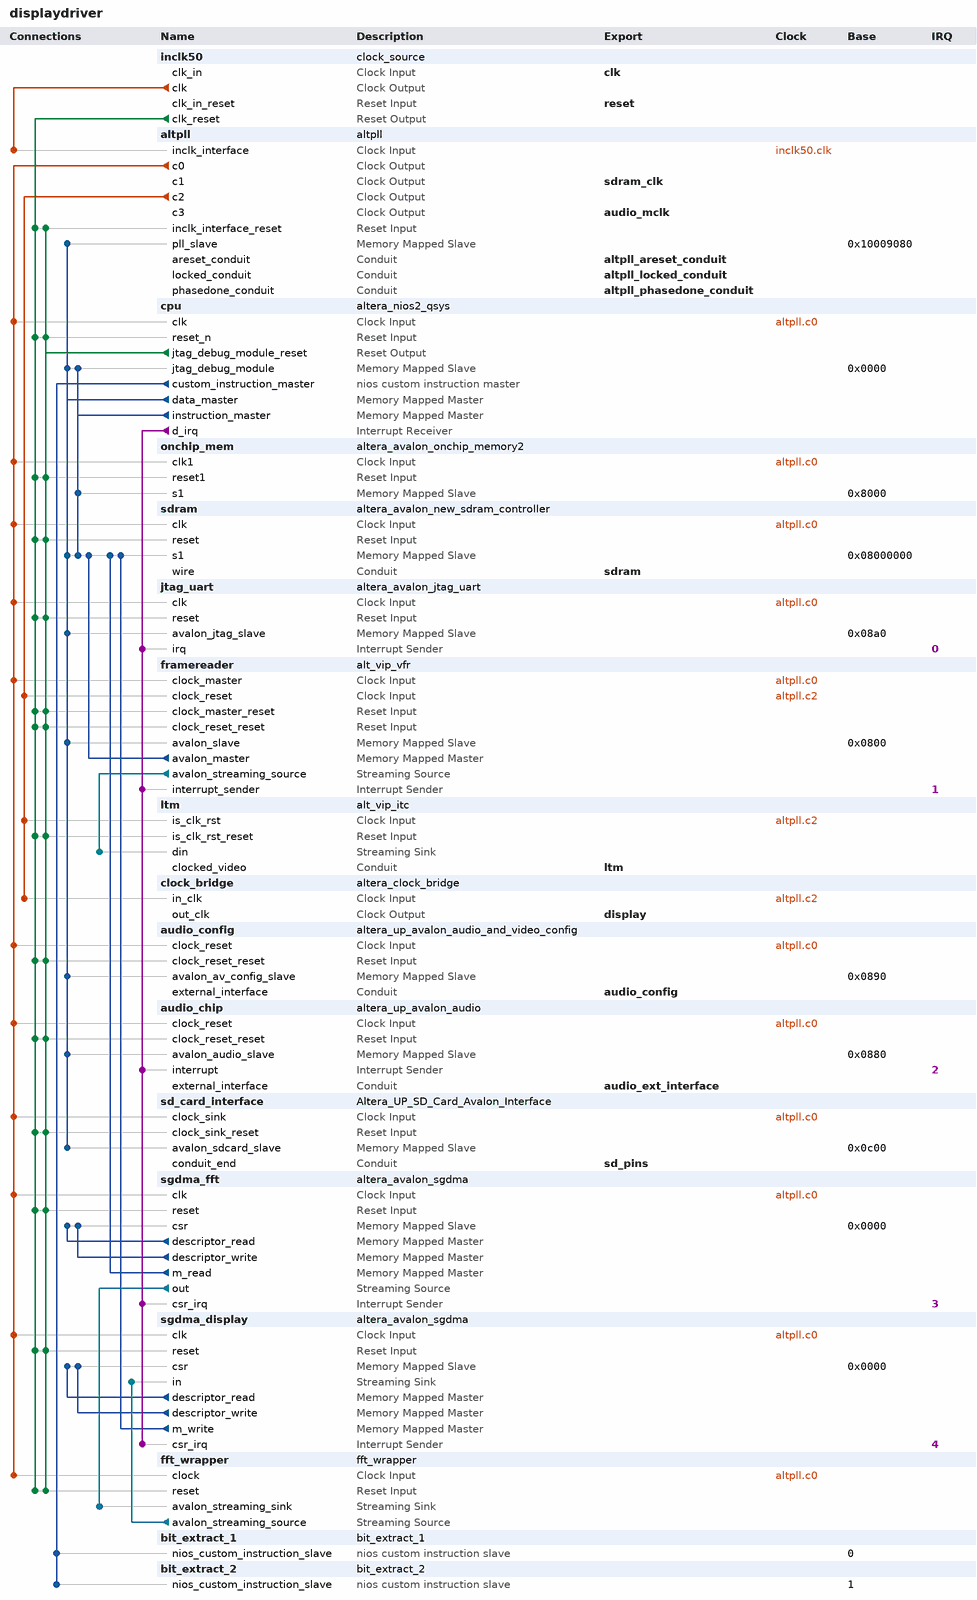
[diagram p0: system contents]
# Platform Designer (Qsys) system displaydriver, Cyclone IV E EP4CE115F29C7
# Parameters at their usual value, and those the tool derives, are not listed.
package require -exact qsys 13.1
create_system displaydriver
set_project_property DEVICE_FAMILY {Cyclone IV E}
set_project_property DEVICE EP4CE115F29C7

add_instance inclk50 clock_source 13.1
set_instance_parameter_value inclk50 clockFrequency 50000000

add_instance altpll altpll 13.1
set_instance_parameter_value altpll INCLK0_INPUT_FREQUENCY 20000
set_instance_parameter_value altpll CLK0_MULTIPLY_BY 2
set_instance_parameter_value altpll CLK1_MULTIPLY_BY 2
set_instance_parameter_value altpll CLK2_MULTIPLY_BY 1
set_instance_parameter_value altpll CLK3_MULTIPLY_BY 3528
set_instance_parameter_value altpll CLK0_DIVIDE_BY 1
set_instance_parameter_value altpll CLK1_DIVIDE_BY 1
set_instance_parameter_value altpll CLK2_DIVIDE_BY 2
set_instance_parameter_value altpll CLK3_DIVIDE_BY 15625
set_instance_parameter_value altpll CLK1_PHASE_SHIFT -1833
set_instance_parameter_value altpll CLK2_PHASE_SHIFT 0
set_instance_parameter_value altpll CLK3_PHASE_SHIFT 0
set_instance_parameter_value altpll CLK1_DUTY_CYCLE 50
set_instance_parameter_value altpll CLK2_DUTY_CYCLE 50
set_instance_parameter_value altpll CLK3_DUTY_CYCLE 50
set_instance_parameter_value altpll PORT_clk1 PORT_USED
set_instance_parameter_value altpll PORT_clk2 PORT_USED
set_instance_parameter_value altpll PORT_clk3 PORT_USED
set_instance_parameter_value altpll PORT_ARESET PORT_USED
set_instance_parameter_value altpll PORT_LOCKED PORT_USED

add_instance cpu altera_nios2_qsys 13.1
set_instance_parameter_value cpu resetSlave onchip_mem.s1
set_instance_parameter_value cpu exceptionSlave onchip_mem.s1
set_instance_parameter_value cpu breakSlave cpu.jtag_debug_module
set_instance_parameter_value cpu muldiv_multiplierType LogicElementsFast
set_instance_parameter_value cpu impl Small
set_instance_parameter_value cpu icache_size 4096

add_instance onchip_mem altera_avalon_onchip_memory2 13.1
set_instance_parameter_value onchip_mem dataWidth 32
set_instance_parameter_value onchip_mem dualPort false
set_instance_parameter_value onchip_mem initMemContent true
set_instance_parameter_value onchip_mem initializationFileName onchip_mem
set_instance_parameter_value onchip_mem memorySize 20480

add_instance sdram altera_avalon_new_sdram_controller 13.1
set_instance_parameter_value sdram TAC 5.5
set_instance_parameter_value sdram TRCD 20.0
set_instance_parameter_value sdram TRP 20.0
set_instance_parameter_value sdram casLatency 3
set_instance_parameter_value sdram columnWidth 10
set_instance_parameter_value sdram dataWidth 32
set_instance_parameter_value sdram generateSimulationModel true
set_instance_parameter_value sdram model custom
set_instance_parameter_value sdram numberOfBanks 4
set_instance_parameter_value sdram numberOfChipSelects 1
set_instance_parameter_value sdram powerUpDelay 100.0
set_instance_parameter_value sdram refreshPeriod 15.625
set_instance_parameter_value sdram rowWidth 13

add_instance jtag_uart altera_avalon_jtag_uart 13.1
set_instance_parameter_value jtag_uart simInteractiveOptions INTERACTIVE_ASCII_OUTPUT

add_instance framereader alt_vip_vfr 13.1
set_instance_parameter_value framereader NUMBER_OF_CHANNELS_IN_PARALLEL 3
set_instance_parameter_value framereader MAX_IMAGE_WIDTH 800
set_instance_parameter_value framereader MAX_IMAGE_HEIGHT 480
set_instance_parameter_value framereader MEM_PORT_WIDTH 32

add_instance ltm alt_vip_itc 13.1
set_instance_parameter_value ltm NUMBER_OF_COLOUR_PLANES 3
set_instance_parameter_value ltm H_ACTIVE_PIXELS 800
set_instance_parameter_value ltm V_ACTIVE_LINES 480
set_instance_parameter_value ltm FIFO_DEPTH 1024
set_instance_parameter_value ltm CLOCKS_ARE_SAME 1
set_instance_parameter_value ltm THRESHOLD 1023
set_instance_parameter_value ltm H_SYNC_LENGTH 1
set_instance_parameter_value ltm H_FRONT_PORCH 40
set_instance_parameter_value ltm H_BACK_PORCH 216
set_instance_parameter_value ltm V_SYNC_LENGTH 1
set_instance_parameter_value ltm V_FRONT_PORCH 10
set_instance_parameter_value ltm V_BACK_PORCH 35

add_instance clock_bridge altera_clock_bridge 13.1
set_instance_parameter_value clock_bridge DERIVED_CLOCK_RATE 25000000
set_instance_parameter_value clock_bridge EXPLICIT_CLOCK_RATE 0

add_instance audio_config altera_up_avalon_audio_and_video_config 13.1
set_instance_parameter_value audio_config board DE2-115
set_instance_parameter_value audio_config audio_in {Microphone to ADC}
set_instance_parameter_value audio_config line_in_bypass false
set_instance_parameter_value audio_config bit_length 16
set_instance_parameter_value audio_config sampling_rate {48 kHz}

add_instance audio_chip altera_up_avalon_audio 13.1
set_instance_parameter_value audio_chip avalon_bus_type {Memory Mapped}
set_instance_parameter_value audio_chip audio_in true
set_instance_parameter_value audio_chip dw 16

add_instance sd_card_interface Altera_UP_SD_Card_Avalon_Interface 13.1

add_instance sgdma_fft altera_avalon_sgdma 13.1
set_instance_parameter_value sgdma_fft enableBurstTransfers false
set_instance_parameter_value sgdma_fft enableUnalignedTransfers false
set_instance_parameter_value sgdma_fft readBlockDataWidth 16
set_instance_parameter_value sgdma_fft readBurstcountWidth 16
set_instance_parameter_value sgdma_fft sinkErrorWidth 0
set_instance_parameter_value sgdma_fft sourceErrorWidth 0
set_instance_parameter_value sgdma_fft transferMode MEMORY_TO_STREAM
set_instance_parameter_value sgdma_fft writeBurstcountWidth 4

add_instance sgdma_display altera_avalon_sgdma 13.1
set_instance_parameter_value sgdma_display enableBurstTransfers false
set_instance_parameter_value sgdma_display enableUnalignedTransfers false
set_instance_parameter_value sgdma_display readBlockDataWidth 16
set_instance_parameter_value sgdma_display sinkErrorWidth 2
set_instance_parameter_value sgdma_display sourceErrorWidth 0
set_instance_parameter_value sgdma_display transferMode STREAM_TO_MEMORY
set_instance_parameter_value sgdma_display writeBurstcountWidth 4

add_instance fft_wrapper fft_wrapper 1.0

add_instance bit_extract_1 bit_extract_1 1.0

add_instance bit_extract_2 bit_extract_2 1.0

# connections
add_connection altpll.c0 audio_chip.clock_reset clock
add_connection altpll.c0 audio_config.clock_reset clock
add_connection altpll.c0 cpu.clk clock
add_connection altpll.c0 fft_wrapper.clock clock
add_connection altpll.c0 framereader.clock_master clock
add_connection altpll.c0 jtag_uart.clk clock
add_connection altpll.c0 onchip_mem.clk1 clock
add_connection altpll.c0 sd_card_interface.clock_sink clock
add_connection altpll.c0 sdram.clk clock
add_connection altpll.c0 sgdma_display.clk clock
add_connection altpll.c0 sgdma_fft.clk clock
add_connection altpll.c2 clock_bridge.in_clk clock
add_connection altpll.c2 framereader.clock_reset clock
add_connection altpll.c2 ltm.is_clk_rst clock
add_connection inclk50.clk altpll.inclk_interface clock
add_connection cpu.jtag_debug_module_reset altpll.inclk_interface_reset reset
add_connection cpu.jtag_debug_module_reset audio_chip.clock_reset_reset reset
add_connection cpu.jtag_debug_module_reset audio_config.clock_reset_reset reset
add_connection cpu.jtag_debug_module_reset cpu.reset_n reset
add_connection cpu.jtag_debug_module_reset fft_wrapper.reset reset
add_connection cpu.jtag_debug_module_reset framereader.clock_master_reset reset
add_connection cpu.jtag_debug_module_reset framereader.clock_reset_reset reset
add_connection cpu.jtag_debug_module_reset jtag_uart.reset reset
add_connection cpu.jtag_debug_module_reset ltm.is_clk_rst_reset reset
add_connection cpu.jtag_debug_module_reset onchip_mem.reset1 reset
add_connection cpu.jtag_debug_module_reset sd_card_interface.clock_sink_reset reset
add_connection cpu.jtag_debug_module_reset sdram.reset reset
add_connection cpu.jtag_debug_module_reset sgdma_display.reset reset
add_connection cpu.jtag_debug_module_reset sgdma_fft.reset reset
add_connection inclk50.clk_reset altpll.inclk_interface_reset reset
add_connection inclk50.clk_reset audio_chip.clock_reset_reset reset
add_connection inclk50.clk_reset audio_config.clock_reset_reset reset
add_connection inclk50.clk_reset cpu.reset_n reset
add_connection inclk50.clk_reset fft_wrapper.reset reset
add_connection inclk50.clk_reset framereader.clock_master_reset reset
add_connection inclk50.clk_reset framereader.clock_reset_reset reset
add_connection inclk50.clk_reset jtag_uart.reset reset
add_connection inclk50.clk_reset ltm.is_clk_rst_reset reset
add_connection inclk50.clk_reset onchip_mem.reset1 reset
add_connection inclk50.clk_reset sd_card_interface.clock_sink_reset reset
add_connection inclk50.clk_reset sdram.reset reset
add_connection inclk50.clk_reset sgdma_display.reset reset
add_connection inclk50.clk_reset sgdma_fft.reset reset
add_connection cpu.data_master altpll.pll_slave avalon
set_connection_parameter_value cpu.data_master/altpll.pll_slave baseAddress 0x10009080
add_connection cpu.data_master audio_chip.avalon_audio_slave avalon
set_connection_parameter_value cpu.data_master/audio_chip.avalon_audio_slave baseAddress 0x0880
add_connection cpu.data_master audio_config.avalon_av_config_slave avalon
set_connection_parameter_value cpu.data_master/audio_config.avalon_av_config_slave baseAddress 0x0890
add_connection cpu.data_master cpu.jtag_debug_module avalon
set_connection_parameter_value cpu.data_master/cpu.jtag_debug_module baseAddress 0x0000
add_connection cpu.data_master framereader.avalon_slave avalon
set_connection_parameter_value cpu.data_master/framereader.avalon_slave baseAddress 0x0800
add_connection cpu.data_master jtag_uart.avalon_jtag_slave avalon
set_connection_parameter_value cpu.data_master/jtag_uart.avalon_jtag_slave baseAddress 0x08a0
add_connection cpu.data_master sd_card_interface.avalon_sdcard_slave avalon
set_connection_parameter_value cpu.data_master/sd_card_interface.avalon_sdcard_slave baseAddress 0x0c00
add_connection cpu.data_master sdram.s1 avalon
set_connection_parameter_value cpu.data_master/sdram.s1 baseAddress 0x08000000
add_connection cpu.instruction_master cpu.jtag_debug_module avalon
set_connection_parameter_value cpu.instruction_master/cpu.jtag_debug_module baseAddress 0x0000
add_connection cpu.instruction_master onchip_mem.s1 avalon
set_connection_parameter_value cpu.instruction_master/onchip_mem.s1 baseAddress 0x8000
add_connection cpu.instruction_master sdram.s1 avalon
set_connection_parameter_value cpu.instruction_master/sdram.s1 baseAddress 0x08000000
add_connection framereader.avalon_master sdram.s1 avalon
set_connection_parameter_value framereader.avalon_master/sdram.s1 baseAddress 0x08000000
add_connection sgdma_display.descriptor_read sgdma_display.csr avalon
set_connection_parameter_value sgdma_display.descriptor_read/sgdma_display.csr baseAddress 0x0000
add_connection sgdma_display.descriptor_write sgdma_display.csr avalon
set_connection_parameter_value sgdma_display.descriptor_write/sgdma_display.csr baseAddress 0x0000
add_connection sgdma_display.m_write sdram.s1 avalon
set_connection_parameter_value sgdma_display.m_write/sdram.s1 baseAddress 0x08000000
add_connection sgdma_fft.descriptor_read sgdma_fft.csr avalon
set_connection_parameter_value sgdma_fft.descriptor_read/sgdma_fft.csr baseAddress 0x0000
add_connection sgdma_fft.descriptor_write sgdma_fft.csr avalon
set_connection_parameter_value sgdma_fft.descriptor_write/sgdma_fft.csr baseAddress 0x0000
add_connection sgdma_fft.m_read sdram.s1 avalon
set_connection_parameter_value sgdma_fft.m_read/sdram.s1 baseAddress 0x08000000
add_connection fft_wrapper.avalon_streaming_source sgdma_display.in avalon_streaming
add_connection framereader.avalon_streaming_source ltm.din avalon_streaming
add_connection sgdma_fft.out fft_wrapper.avalon_streaming_sink avalon_streaming
add_connection cpu.d_irq audio_chip.interrupt interrupt
set_connection_parameter_value cpu.d_irq/audio_chip.interrupt irqNumber 2
add_connection cpu.d_irq framereader.interrupt_sender interrupt
set_connection_parameter_value cpu.d_irq/framereader.interrupt_sender irqNumber 1
add_connection cpu.d_irq jtag_uart.irq interrupt
set_connection_parameter_value cpu.d_irq/jtag_uart.irq irqNumber 0
add_connection cpu.d_irq sgdma_display.csr_irq interrupt
set_connection_parameter_value cpu.d_irq/sgdma_display.csr_irq irqNumber 4
add_connection cpu.d_irq sgdma_fft.csr_irq interrupt
set_connection_parameter_value cpu.d_irq/sgdma_fft.csr_irq irqNumber 3
add_connection cpu.custom_instruction_master bit_extract_1.nios_custom_instruction_slave nios_custom_instruction
set_connection_parameter_value cpu.custom_instruction_master/bit_extract_1.nios_custom_instruction_slave CIName bit_extract_1_0
set_connection_parameter_value cpu.custom_instruction_master/bit_extract_1.nios_custom_instruction_slave baseAddress 0
add_connection cpu.custom_instruction_master bit_extract_2.nios_custom_instruction_slave nios_custom_instruction
set_connection_parameter_value cpu.custom_instruction_master/bit_extract_2.nios_custom_instruction_slave CIName bit_extract_2
set_connection_parameter_value cpu.custom_instruction_master/bit_extract_2.nios_custom_instruction_slave baseAddress 1

# exported interfaces
add_interface clk clock sink
set_interface_property clk EXPORT_OF inclk50.clk_in
add_interface reset reset sink
set_interface_property reset EXPORT_OF inclk50.clk_in_reset
add_interface altpll_phasedone_conduit conduit end
set_interface_property altpll_phasedone_conduit EXPORT_OF altpll.phasedone_conduit
add_interface altpll_locked_conduit conduit end
set_interface_property altpll_locked_conduit EXPORT_OF altpll.locked_conduit
add_interface altpll_areset_conduit conduit end
set_interface_property altpll_areset_conduit EXPORT_OF altpll.areset_conduit
add_interface sdram conduit end
set_interface_property sdram EXPORT_OF sdram.wire
add_interface sdram_clk clock source
set_interface_property sdram_clk EXPORT_OF altpll.c1
add_interface ltm conduit end
set_interface_property ltm EXPORT_OF ltm.clocked_video
add_interface audio_mclk clock source
set_interface_property audio_mclk EXPORT_OF altpll.c3
add_interface audio_config conduit end
set_interface_property audio_config EXPORT_OF audio_config.external_interface
add_interface audio_ext_interface conduit end
set_interface_property audio_ext_interface EXPORT_OF audio_chip.external_interface
add_interface sd_pins conduit end
set_interface_property sd_pins EXPORT_OF sd_card_interface.conduit_end
add_interface display clock source
set_interface_property display EXPORT_OF clock_bridge.out_clk

set_interconnect_requirement {$system} qsys_mm.clockCrossingAdapter HANDSHAKE
set_interconnect_requirement {$system} qsys_mm.maxAdditionalLatency 0

save_system displaydriver.qsys
